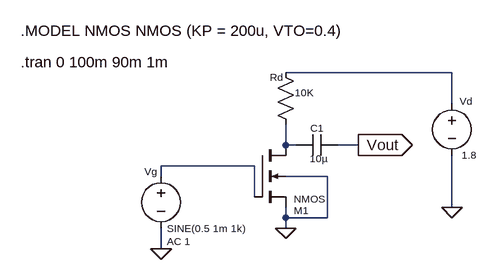
[diagram p0: schematic CMOS CS AMP.asc]
CMOS CS AMP.asc, the LTspice schematic file:
Version 4
SHEET 1 880 680
WIRE 464 16 208 16
WIRE 464 64 464 16
WIRE 208 128 208 96
WIRE 224 128 208 128
WIRE 320 128 288 128
WIRE 160 160 16 160
WIRE 16 176 16 160
WIRE 272 176 208 176
WIRE 160 208 160 160
WIRE 464 224 464 144
WIRE 208 240 208 224
WIRE 272 240 272 176
WIRE 272 240 208 240
WIRE 208 256 208 240
WIRE 16 288 16 256
FLAG 208 256 0
FLAG 16 288 0
FLAG 320 128 Vout
IOPIN 320 128 Out
FLAG 464 224 0
SYMBOL voltage 16 160 R0
WINDOW 0 -25 9 Left 1
WINDOW 3 9 96 Left 1
WINDOW 123 9 116 Left 1
WINDOW 39 0 0 Left 0
SYMATTR InstName Vg
SYMATTR Value SINE(0.5 1m 1k)
SYMATTR Value2 AC 1
SYMBOL res 192 0 R0
WINDOW 0 -8 23 Left 1
WINDOW 3 30 47 Left 1
SYMATTR InstName Rd
SYMATTR Value 10K
SYMBOL cap 288 112 R90
WINDOW 0 0 32 VBottom 1
WINDOW 3 47 29 VBottom 1
SYMATTR InstName C1
SYMATTR Value 10µ
SYMBOL voltage 464 48 R0
WINDOW 0 12 12 Left 1
WINDOW 3 15 95 Left 1
WINDOW 123 0 0 Left 0
WINDOW 39 0 0 Left 0
SYMATTR InstName Vd
SYMATTR Value 1.8
SYMBOL nmos4 160 128 R0
WINDOW 0 61 101 Left 1
WINDOW 3 61 83 Left 1
SYMATTR InstName M1
SYMATTR Value2 l=0.18u w=18u
TEXT -200 -48 Left 2 !.MODEL NMOS NMOS (KP = 200u, VTO=0.4)
TEXT -200 0 Left 2 !.tran 0 100m 90m 1m

The netlist it stands for:
* CMOS CS AMP.asc
Vg N003 0 SINE(0.5 1m 1k) AC 1
Rd N001 N002 10K
C1 Vout N002 10µ
Vd N001 0 1.8
M1 N002 N003 0 0 NMOS l=0.18u w=18u
.model NMOS NMOS
.model PMOS PMOS
.lib standard.mos
.MODEL NMOS NMOS (KP = 200u, VTO=0.4)
.tran 0 100m 90m 1m
.backanno
.end